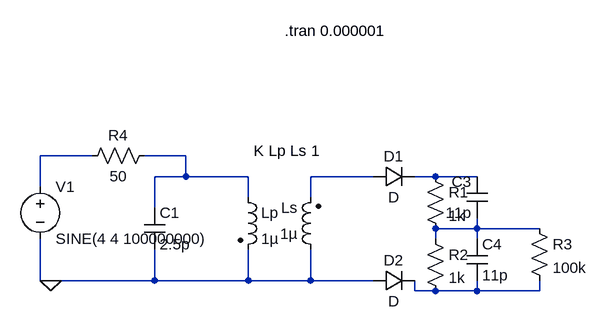
[diagram p0: schematic Transformer.asc]
Transformer.asc, the LTspice schematic file:
Version 4
SHEET 1 896 680
WIRE 128 208 48 208
WIRE 272 208 208 208
WIRE 272 240 272 208
WIRE 272 240 224 240
WIRE 368 240 272 240
WIRE 560 240 464 240
WIRE 656 240 624 240
WIRE 720 240 656 240
WIRE 48 256 48 208
WIRE 368 272 368 240
WIRE 464 272 464 240
WIRE 224 288 224 240
WIRE 720 320 720 304
WIRE 720 320 656 320
WIRE 816 320 720 320
WIRE 656 336 656 320
WIRE 720 336 720 320
WIRE 48 400 48 336
WIRE 64 400 48 400
WIRE 224 400 224 352
WIRE 224 400 64 400
WIRE 368 400 368 352
WIRE 368 400 224 400
WIRE 464 400 464 352
WIRE 464 400 368 400
WIRE 560 400 464 400
WIRE 624 416 624 400
WIRE 656 416 624 416
WIRE 720 416 720 400
WIRE 720 416 656 416
WIRE 816 416 816 400
WIRE 816 416 720 416
FLAG 64 400 0
SYMBOL cap 208 288 R0
SYMATTR InstName C1
SYMATTR Value 2.5p
SYMBOL cap 736 304 R180
WINDOW 0 24 56 Left 2
WINDOW 3 24 8 Left 2
SYMATTR InstName C3
SYMATTR Value 11p
SYMBOL diode 560 256 R270
WINDOW 0 32 32 VTop 2
WINDOW 3 0 32 VBottom 2
SYMATTR InstName D1
SYMBOL diode 560 416 R270
WINDOW 0 32 32 VTop 2
WINDOW 3 0 32 VBottom 2
SYMATTR InstName D2
SYMBOL res 640 224 R0
SYMATTR InstName R1
SYMATTR Value 1k
SYMBOL res 640 320 R0
SYMATTR InstName R2
SYMATTR Value 1k
SYMBOL cap 704 336 R0
SYMATTR InstName C4
SYMATTR Value 11p
SYMBOL voltage 48 240 R0
SYMATTR InstName V1
SYMATTR Value SINE(4 4 100000000)
SYMBOL res 800 304 R0
SYMATTR InstName R3
SYMATTR Value 100k
SYMBOL res 224 192 R90
WINDOW 0 0 56 VBottom 2
WINDOW 3 32 56 VTop 2
SYMATTR InstName R4
SYMATTR Value 50
SYMBOL ind2 480 368 R180
WINDOW 0 36 80 Left 2
WINDOW 3 36 40 Left 2
SYMATTR InstName Ls
SYMATTR Value 1µ
SYMATTR Type ind
SYMBOL ind2 352 256 R0
SYMATTR InstName Lp
SYMATTR Value 1µ
SYMATTR Type ind
TEXT 424 16 Left 2 !.tran 0.000001
TEXT 376 200 Left 2 !K Lp Ls 1

The netlist it stands for:
* Transformer.asc
C1 N002 0 2.5p
C3 N005 N004 11p
D1 N003 N004 D
D2 0 N006 D
R1 N004 N005 1k
R2 N005 N006 1k
C4 N005 N006 11p
V1 N001 0 SINE(4 4 100000000)
R3 N005 N006 100k
R4 N002 N001 50
Ls 0 N003 1µ
Lp N002 0 1µ
.model D D
.lib standard.dio
.tran 0.000001
K Lp Ls 1
.backanno
.end